# Altium schematic sheet Keyboard.SchDoc
size B; SheetNumber: 1; SheetTotal: 2
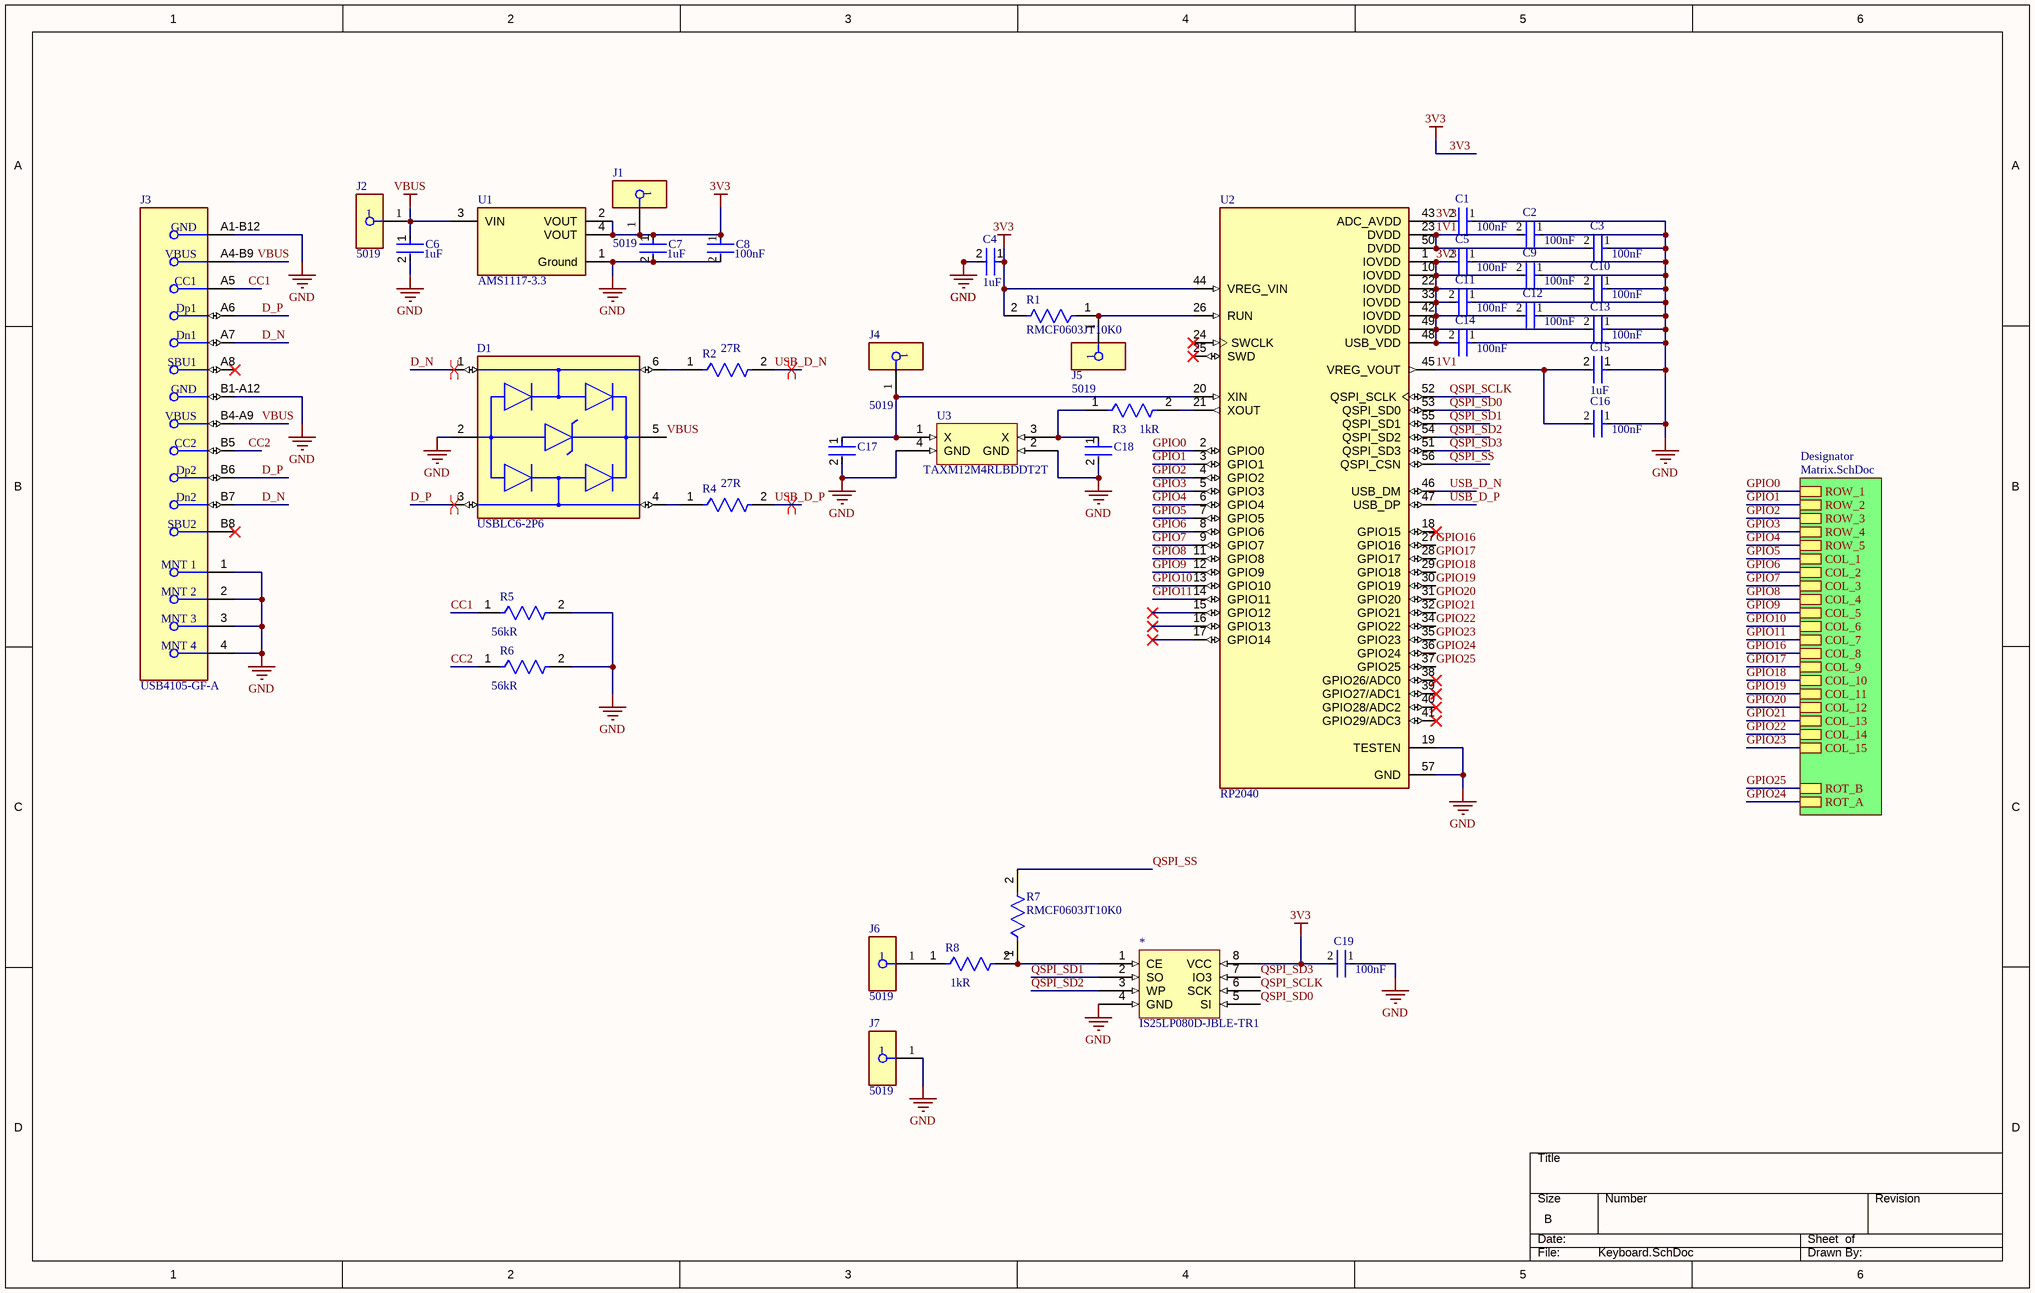
[diagram p0: Keyboard.SchDoc]

## Parts
*  IS25LP080D-JBLE-TR1  [SOIC127P790X216-8N]
C1  Capacitance: 100nF  [FP-GRM155-0_05-MFG]  (hidden comment: GRM155R71C104KA88J)
C2  Capacitance: 100nF  [FP-GRM155-0_05-MFG]  (hidden comment: GRM155R71C104KA88J)
C3  Capacitance: 100nF  [FP-GRM155-0_05-MFG]  (hidden comment: GRM155R71C104KA88J)
C4  Capacitance: 1uF  [FP-CL10-IPC_A]  (hidden comment: CL10A105KO8NNNC)
C5  Capacitance: 100nF  [FP-GRM155-0_05-MFG]  (hidden comment: GRM155R71C104KA88J)
C6  Capacitance: 1uF  [FP-CL10-IPC_A]  (hidden comment: CL10A105KO8NNNC)
C7  Capacitance: 1uF  [FP-CL10-IPC_A]  (hidden comment: CL10A105KO8NNNC)
C8  Capacitance: 100nF  [FP-GRM155-0_05-MFG]  (hidden comment: GRM155R71C104KA88J)
C9  Capacitance: 100nF  [FP-GRM155-0_05-MFG]  (hidden comment: GRM155R71C104KA88J)
C10  Capacitance: 100nF  [FP-GRM155-0_05-MFG]  (hidden comment: GRM155R71C104KA88J)
C11  Capacitance: 100nF  [FP-GRM155-0_05-MFG]  (hidden comment: GRM155R71C104KA88J)
C12  Capacitance: 100nF  [FP-GRM155-0_05-MFG]  (hidden comment: GRM155R71C104KA88J)
C13  Capacitance: 100nF  [FP-GRM155-0_05-MFG]  (hidden comment: GRM155R71C104KA88J)
C14  Capacitance: 100nF  [FP-GRM155-0_05-MFG]  (hidden comment: GRM155R71C104KA88J)
C15  Capacitance: 1uF  [FP-CL10-IPC_A]  (hidden comment: CL10A105KO8NNNC)
C16  Capacitance: 100nF  [FP-GRM155-0_05-MFG]  (hidden comment: GRM155R71C104KA88J)
C17  GQM2195C2E320JB12D  [FP-GQM219-0_15-IPC_C]  (value not drawn)
C18  GQM2195C2E320JB12D  [FP-GQM219-0_15-IPC_C]  (value not drawn)
C19  Capacitance: 100nF  [FP-GRM155-0_05-MFG]  (hidden comment: GRM155R71C104KA88J)
D1  USBLC6-2P6  [FP-SOT-666-MFG]
J1  5019  [FP-5019-MFG]
J2  5019  [FP-5019-MFG]
J3  USB4105-GF-A  [FP-USB4105-GF-A-MFG]
J4  5019  [FP-5019-MFG]
J5  5019  [FP-5019-MFG]
J6  5019  [FP-5019-MFG]
J7  5019  [FP-5019-MFG]
R1  RMCF0603JT10K0  [FP-RMCF0603-IPC_C]
R2  Resistance: 27R  [FP-RMCF0603-IPC_B]  (hidden comment: RMCF0603FT27R0)
R3  Resistance: 1kR  [FP-RC0603-0_55-IPC_C]  (hidden comment: RC0603FR-071KL)
R4  Resistance: 27R  [FP-RMCF0603-IPC_B]  (hidden comment: RMCF0603FT27R0)
R5  Resistance: 56kR  [FP-RMCF1206-MFG]  (hidden comment: RMCF1206JT56K0)
R6  Resistance: 56kR  [FP-RMCF1206-MFG]  (hidden comment: RMCF1206JT56K0)
R7  RMCF0603JT10K0  [FP-RMCF0603-IPC_C]
R8  Resistance: 1kR  [FP-RC0603-0_55-IPC_C]  (hidden comment: RC0603FR-071KL)
U1  AMS1117-3.3  [FP-AMS1117-IPC_C]
U2  RP2040  [QFN40P700X700X90-57N]
U3  TAXM12M4RLBDDT2T  [TAXM12M4RLBDDT2T]

## Sub-sheets
Designator = Matrix.SchDoc: ROW_1, ROW_2, ROW_3, ROW_4, ROW_5, COL_1, COL_2, COL_3, COL_4, COL_5, COL_6, COL_7, COL_8, COL_9, COL_10, COL_11, COL_12, COL_13, COL_14, COL_15, ROT_B, ROT_A

## Nets
3V3: *.8(VCC) C1.2 C4.1 C5.2 C7.1 C8.1 C9.2 C10.2 C11.2 C12.2 C13.2 C14.2 C19.2 J1.1 R1.2 U1.2(VOUT) U1.4(VOUT) U2.1(IOVDD) U2.10(IOVDD) U2.22(IOVDD) U2.33(IOVDD) U2.42(IOVDD) U2.43(ADC_AVDD) U2.44(VREG_VIN) U2.48(USB_VDD) U2.49(IOVDD)
GND: *.4(GND) C1.1 C2.1 C3.1 C4.2 C5.1 C6.2 C7.2 C8.2 C9.1 C10.1 C11.1 C12.1 C13.1 C14.1 C15.1 C16.1 C17.2 C18.2 C19.1 D1.2(GND) J3.1(MNT_1) J3.2(MNT_2) J3.3(MNT_3) J3.4(MNT_4) J3.A1-B12(GND) J3.B1-A12(GND) J7.1 R5.2 R6.2 U1.1(Ground) U2.19(TESTEN) U2.57(GND) U3.2(GND) U3.4(GND)
VBUS: C6.1 D1.5(VBUS) J2.1 J3.A4-B9(VBUS) J3.B4-A9(VBUS) U1.3(VIN)
1V1: C2.2 C3.2 C15.2 C16.2 U2.23(DVDD) U2.45(VREG_VOUT) U2.50(DVDD)
CC1: J3.A5(CC1) R5.1
CC2: J3.B5(CC2) R6.1
D_N: D1.1(I/O1) J3.A7(Dn1) J3.B7(Dn2)
D_P: D1.3(I/O2) J3.A6(Dp1) J3.B6(Dp2)
GPIO0: U2.2(GPIO0) ; sheet Designator/ROW_1
GPIO1: U2.3(GPIO1) ; sheet Designator/ROW_2
GPIO2: U2.4(GPIO2) ; sheet Designator/ROW_3
GPIO3: U2.5(GPIO3) ; sheet Designator/ROW_4
GPIO4: U2.6(GPIO4) ; sheet Designator/ROW_5
GPIO5: U2.7(GPIO5) ; sheet Designator/COL_1
GPIO6: U2.8(GPIO6) ; sheet Designator/COL_2
GPIO7: U2.9(GPIO7) ; sheet Designator/COL_3
GPIO8: U2.11(GPIO8) ; sheet Designator/COL_4
GPIO9: U2.12(GPIO9) ; sheet Designator/COL_5
GPIO10: U2.13(GPIO10) ; sheet Designator/COL_6
GPIO11: U2.14(GPIO11) ; sheet Designator/COL_7
GPIO16: U2.27(GPIO16) ; sheet Designator/COL_8
GPIO17: U2.28(GPIO17) ; sheet Designator/COL_9
GPIO18: U2.29(GPIO18) ; sheet Designator/COL_10
GPIO19: U2.30(GPIO19) ; sheet Designator/COL_11
GPIO20: U2.31(GPIO20) ; sheet Designator/COL_12
GPIO21: U2.32(GPIO21) ; sheet Designator/COL_13
GPIO22: U2.34(GPIO22) ; sheet Designator/COL_14
GPIO23: U2.35(GPIO23) ; sheet Designator/COL_15
GPIO24: U2.36(GPIO24) ; sheet Designator/ROT_A
GPIO25: U2.37(GPIO25) ; sheet Designator/ROT_B
QSPI_SCLK: *.6(SCK) U2.52(QSPI_SCLK)
QSPI_SD0: *.5(SI) U2.53(QSPI_SD0)
QSPI_SD1: *.2(SO) U2.55(QSPI_SD1)
QSPI_SD2: *.3(WP) U2.54(QSPI_SD2)
QSPI_SD3: *.7(IO3) U2.51(QSPI_SD3)
QSPI_SS: R7.2 U2.56(QSPI_CSN)
USB_D_N: R2.2 U2.46(USB_DM)
USB_D_P: R4.2 U2.47(USB_DP)
Net*_1: *.1(CE) R7.1 R8.2
NetC17_1: C17.1 J4.1 U2.20(XIN) U3.1(X)
NetC18_1: C18.1 R3.1 U3.3(X)
NetD1_4: D1.4(I/O2) R4.1
NetD1_6: D1.6(I/O1) R2.1
NetJ5_1: J5.1 R1.1 U2.26(RUN)
NetJ6_1: J6.1 R8.1
NetR3_2: R3.2 U2.21(XOUT)

Not connected (* = marked no-connect by the designer): J3 A8(SBU1)* B8(SBU2)*; U2 15(GPIO12)* 16(GPIO13)* 17(GPIO14)* 18(GPIO15)* 24(SWCLK)* 25(SWD)* 38(GPIO26/ADC0)* 39(GPIO27/ADC1)* 40(GPIO28/ADC2)* 41(GPIO29/ADC3)*

## Layout directives
differential pair: D_N, D_P, USB_D_N, USB_D_P

## Notes on the sheet
- DWG. NO.
- REV.
- SHT.
- THIS DOCUMENT AND THE DATA DISCLOSED HEREIN OR HEREWITH IS THE PROPERTY OF ALTIUM LIMITED AND MAY BE FREELY DISTRIBUTED IN WHOLE. NO RIGHTS ARE RESERVED OR EXPRESS OR IMPLIED WARANTEE GIVEN.
- REVISION
- DESCRIPTION
- DATE
- APPROVED
- ENG:
- APPROVALS
- PROJECT
- DSN:
- CHK:
- REFERENCE DOCUMENTS
- PROJECT REVISION:
- TITLE
- DOCUMENT REVISION:
- DESIGN ITEM:
- BOM:
- FAB DWG:
- PCB DWG:
- ASSY DWG:
- SCALE:
- SIZE
- B
- CAGE CODE
- FILE NAME
- DWG NO.
- SHEET
- OF
- REV

## Library data of the parts
* = CMP-002-00077-2: Flash
C1-C3 C5 C8-C14 C16 C19 = CMP-2008-03928-2: NexarPartId: 9223238; Manufacturer Lifecycle Status: NRND; Voltage: 16V; Tolerance: 10%; Dielectric: X7R; Material: Ceramic; Schedule B: 8532240020, 8532240020; Mount: Surface Mount; Case/Package: 0402; Case Code (Imperial): 0402; Min Operating Temperature: -55°C; Length: 1mm; Voltage Rating (DC): 16V; Depth: 500µm; Lead Free: Lead Free; Max Operating Temperature: 125°C; Case Code (Metric): 1005; Radiation Hardening: No; Height: 550µm; Voltage Rating: 16V; Packaging: Cut Tape; RoHS: Compliant; Width: 500µm; Number of Pins: 2; REACH SVHC: No SVHC; Termination: SMD/SMT; Thickness: 500µm
C4 C6 C7 C15 = CMP-13271-001457-1: Cap Ceramic 1uF 16V X5R ±10% Pad SMD 0603 +85°C T/R; Dielectric: X5R; Height: 0.8mm; Mount: Surface Mount; Thickness: 0.035inch; Width: 0.031inch; Min Operating Temperature: -55°C; Contact Plating: Tin; Case Code (Imperial): 0603; Depth: 0.8mm; Length: 1.6mm; Max Operating Temperature: 85°C; Packaging: Tape and Reel; Tolerance: 10%; Radiation Hardening: No; Case/Package: 0603; Package Quantity: 1; Voltage Rating: 16V; Case Code (Metric): 1608; Voltage: 16V; Material: Ceramic; Lead Free: Lead Free; Voltage Rating (DC): 16V
C17 C18 = CMP-06035-016346-1: Ceramic Capacitor 32pF ±5% 250VDC C0G 0805 Paper T/R
D1 = CMP-12225-000058-1: TVS DIODE 5.25V 17V SOT666; Min Breakdown Voltage: 6V; Power Line Protection: Yes; Element Configuration: Dual; Test Current: 1mA; Working Voltage: 5V; Number of Channels: 2; Max Reverse Leakage Current: 150nA; Direction: Unidirectional; Peak Pulse Current: 5A; Number of Elements: 1; Capacitance: 3.5pF; Max Breakdown Voltage: 6V; Height: 0.6mm; Depth: 1.3mm; Contact Plating: Tin; Reverse Breakdown Voltage: 6V; REACH SVHC: No SVHC; Operating Supply Voltage: 5V; Width: 1.3mm; Max Operating Temperature: 125°C; Reverse Standoff Voltage: 5V; ESD Protection: Yes; Package Quantity: 1; Termination: SMD/SMT; Length: 1.7mm; Leakage Current: 150nA; Number of Bidirectional Channels: 2; Case/Package: SOT-666; Min Operating Temperature: -40°C; Number of Pins: 6; Clamping Voltage: 17V; Breakdown Voltage: 6V; Lead Free: Lead Free; Radiation Hardening: No; Packaging: Tape and Reel; Mount: Surface Mount; Polarity: Unidirectional
J1 J2 J4-J7 = CMP-1672-00008-2: NexarPartId: 22052288; Number of Contacts: 1; Contact Material: Bronze, Silver; Number of Pins: 1; Lead Free: Lead Free; Packaging: Tape and Reel; Mount: Surface Mount; Height: 2.286mm; Contact Plating: Silver; Material: Bronze; Termination: SMD/SMT; REACH SVHC: No SVHC; RoHS: Compliant
J3 = CMP-245163-000001-1: CONN RCPT USB2.0 TYPEC 5A; Manufacturer: GCT; Voltage Rating: 20V; Is Female: yes; Current Rating: 5/6.25/1.25/0.25A; Number Of Contacts: 16; Conn Orientation: Right Angle; Description: USB - C (Type - C) USB 2.0 Receptacle Connector 24 Position Surface Mount, Right Angle; Through Hole; Device Class L1: Connectors; Category: Conn; Lead Free: Yes; RoHS: TRUE; Temperature Range High: +85°C; Digikey Description: CONN RCPT USB2.0 TYPEC 5A; Device Class L3: unset; ComponentLink2Description: Datasheet; Manufacturer Part Number: USB4105-GF-A; Package: 0; Usb Standard: USB 2.0; Device Class L2: USB Connectors; Automotive: No; Temperature Range Low: -40°C; Height: 3.46mm; Temperature: -40°C to +85°C; Contact Material: Gold,Nickel; ComponentLink2URL: https://gct.co/files/drawings/usb4105.pdf; Octopart: https://octopart.com/usb4105-gf-a-gct-106627878
R1 R7 = CMP-26527-002098-1: 10kΩ ±5% 0.1W 0603 Thick Film Chip Resistor AEC-Q200 compliant; Power Rating: 100mW; Temperature Coefficient: 100ppm/°C; Resistance: 10kR; Radiation Hardening: No; Military Standard: Not; Mount: Surface Mount; Resistor Type: Thick Film; Size Code: 0603; Case/Package: 0603; Min Operating Temperature: -55°C; Construction: Rectangular; Series: RMCF; Width: 0.031inch; Length: 1.55mm; Case Code (Metric): 1608; Depth: 0.8mm; Height: 0.022inch; Packaging: Tape and Reel; Lead Free: Lead Free; Tolerance: 5%; Case Code (Imperial): 0603; Max Operating Temperature: 155°C; Contact Plating: Tin; Max Power Dissipation: 100mW; Features: Automotive AEC-Q200; Number of Terminations: 2
R2 R4 = CMP-26527-005743-1: 27Ω ±1% 0.1W 0603 Thick Film Chip Resistor AEC-Q200 compliant; Max Power Dissipation: 100mW; Temperature Coefficient: 100ppm/°C; Case/Package: 0603; Contact Plating: Tin; Packaging: Tape and Reel; Length: 0.061inch; Radiation Hardening: No; Mount: Surface Mount; Series: RMCF; Min Operating Temperature: -55°C; Lead Free: Lead Free; Width: 0.031inch; Resistor Type: Thick Film; Max Operating Temperature: 155°C; RoHS Compliant: Yes; Case Code (Imperial): 0603; Height: 0.022inch; Number of Terminations: 2; Case Code (Metric): 1608; Tolerance: 1%; Features: Automotive AEC-Q200
R3 R8 = CMP-1659-00009-5: RES 1K OHM 1% 1/10W 0603; Voltage Rating: 50V; Power Rating: 100mW; Temperature Coefficient: 100ppm/°C; Military Standard: Not; REACH SVHC: No SVHC; Size Code: 0603; Features: Moisture Resistant; Number of Terminations: 2; Technology: THICK FILM; Series: RC; Case Code (Metric): 1608; Resistance Tolerance: 1%; Resistor Type: Thick Film; Termination: SMD/SMT; Contact Plating: Tin; Radiation Hardening: No; Min Operating Temperature: -55°C; Max Operating Temperature: 155°C; Packaging: Tape and Reel; Max Power Dissipation: 100mW; RoHS Compliant: Yes; Height: 0.45mm; Lead Free: Lead Free; Case/Package: 0603; Length: 1.6mm; Tolerance: 1%; Case Code (Imperial): 0603; Construction: Rectangular; Depth: 0.8mm
R5 R6 = CMP-26527-003341-1: 56kΩ ±5% 0.25W 1206 Thick Film Chip Resistor AEC-Q200 compliant; Max Power Dissipation: 250mW; Temperature Coefficient: 200ppm/°C; RoHS Compliant: Yes; Number of Terminations: 2; Max Operating Temperature: 155°C; Case/Package: 1206; Case Code (Imperial): 1206; Length: 0.126inch; Size Code: 1206; Height: 0.028inch; Resistor Type: Thick Film; Width: 0.063inch; Power Rating: 250mW; Contact Plating: Tin; Min Operating Temperature: -55°C; Features: Automotive AEC-Q200; Military Standard: Not; Mount: Surface Mount; Depth: 1.6mm; Tolerance: 5%; Lead Free: Lead Free; Packaging: Tape and Reel; Construction: Rectangular; Radiation Hardening: No; Case Code (Metric): 3216; Series: RMCF
U1 = CMP-209535-000001-1: LDO Voltage Regulators 1A, 3.3V; Manufacturer: Advanced Monolithic Systems; Dropout Voltage: 1.1V; Output Type: Fixed; Nominal Supply Current: 5mA; Max Power Dissipation: 1.2W; Max Supply Voltage: 15V; Number Of Outputs: 1; Standoff Height: 0.64mm; Max Junction Temp: +125°C; Height: 1.8mm; Package: AMS1117; Device Class L2: Power Management ICs; ComponentLink2Description: Datasheet; ComponentLink2URL: http://www.advanced-monolithic.com/pdf/ds1117.pdf; Category: IC; RoHS: TRUE; Automotive: No; Device Class L1: Integrated Circuits (ICs); Output Current: 1A; Device Class L3: Voltage Regulators - Linear; Temperature: -40°C to +125°C; Output Voltage: 3.3V; Manufacturer Part Number: AMS1117-3.3; Temperature Range Low: -40°C; Octopart: https://octopart.com/ams1117-3.3-advanced+monolithic+systems-25899300; Lead Free: Yes; Ipc Land Pattern Name: SOT229P700X180-4; Temperature Range High: +125°C
U2 = CMP-027-000000-1: RP2040 chip for Raspberry Pi Pico - ARM® Cortex®-M0+ MCU 32-Bit; MP: RP2040; Design Item ID: RP2040; SnapEDA_Link: https://www.snapeda.com/parts/RP2040/Raspberry+Pi/view-part/?ref=snap; Source: RP2040.SchLib; Pin Count: 57; Value: *; Component Type: Standard; MF: Raspberry Pi; Package: None; Check_prices: https://www.snapeda.com/parts/RP2040/Raspberry+Pi/view-part/?ref=eda
U3 = CMP-00000-2: Crystal 12MHz; Load Capacitance: 20pF; Frequency: 12MHz